# Altium schematic sheet tempsensor.SchDoc
size A4
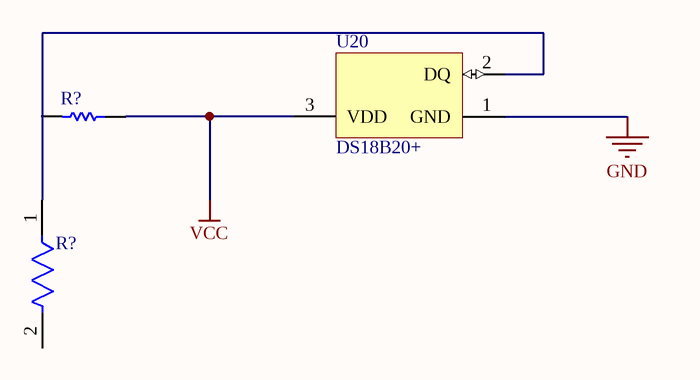
[diagram p0: tempsensor.SchDoc]

## Parts
(Parts that share a designator on the sheet are numbered #1, #2 ... from top to bottom, then left to right.)
R?#1  CRCW08051K00FKEA  [RESC2013X50X30NL20T20]  (value not drawn)
R?#2  CRCW08050000Z0EAHP  [FP-CRCW0805-HPe3-IPC_A]  (value not drawn)
U20  DS18B20+  [Q3+1]

## Nets
GND: U20.1(GND)
VCC: R?#1.1 U20.3(VDD)
NetR?#2_1: R?#2.1 U20.2(DQ)

Not connected (* = marked no-connect by the designer): R?#1 2; R?#2 2

## Library data of the parts
R?#1 = CMP-1013-00510-2: Manufacturer: Vishay Dale; Part Number: CRCW08051K00FKEA
R?#2 = CMP-2001-04185-2: RES Thick Film, 0Ω, 0.5W, 0805; Resistance: 0mR; Max Power Dissipation: 500mW; Power Rating: 330mW; Voltage Rating (DC): 150V; Temperature Coefficient: 0ppm/°C; Tolerance: 5%; Min Operating Temperature: -55°C; Features: Automotive AEC-Q200; Weight: 0.000194oz; Case Code (Metric): 2012; Package Quantity: 5000; Packaging: Tape and Reel; Height: 0.024inch; Composition: Thick Film; Case Code (Imperial): 0805; Military Standard: Not; Number of Pins: 2; Termination: Solder; Lead Free: Lead Free; Max Operating Temperature: 155°C; Radiation Hardening: No; Voltage Rating: 150V; Width: 0.049inch; Number of Terminations: 2; Contact Plating: Tin; Length: 2mm; Depth: 1.25mm; Case/Package: 0805; REACH SVHC: No SVHC; Mount: Surface Mount
U20 = CMP-0253-00003-1: Programmable Resolution Digital Thermometer, 1-Wire Interface, ±0.5°C Accuracy, 3-Pin TO92, -55°C to +125°C, Pb-Free; ComponentLink2URL: http://datasheets.maxim-ic.com/en/ds/DS18B20.pdf; PackageReference: Q3+1; ComponentLink1Description: Manufacturer URL; PackageDescription: TO-92 Package, Body Dia. 4.7mm; Leads 0.51 x 0.51 mm (max), Pb-Free; DatasheetVersion: 2007; Code_JEDEC: TO-226-AA; ComponentLink1URL: http://www.maxim-ic.com; PackageVersion: revB, 2009; ComponentLink2Description: Datasheet